# EAGLE design CCM_0020_transmitter (EAGLE 9.3.2)
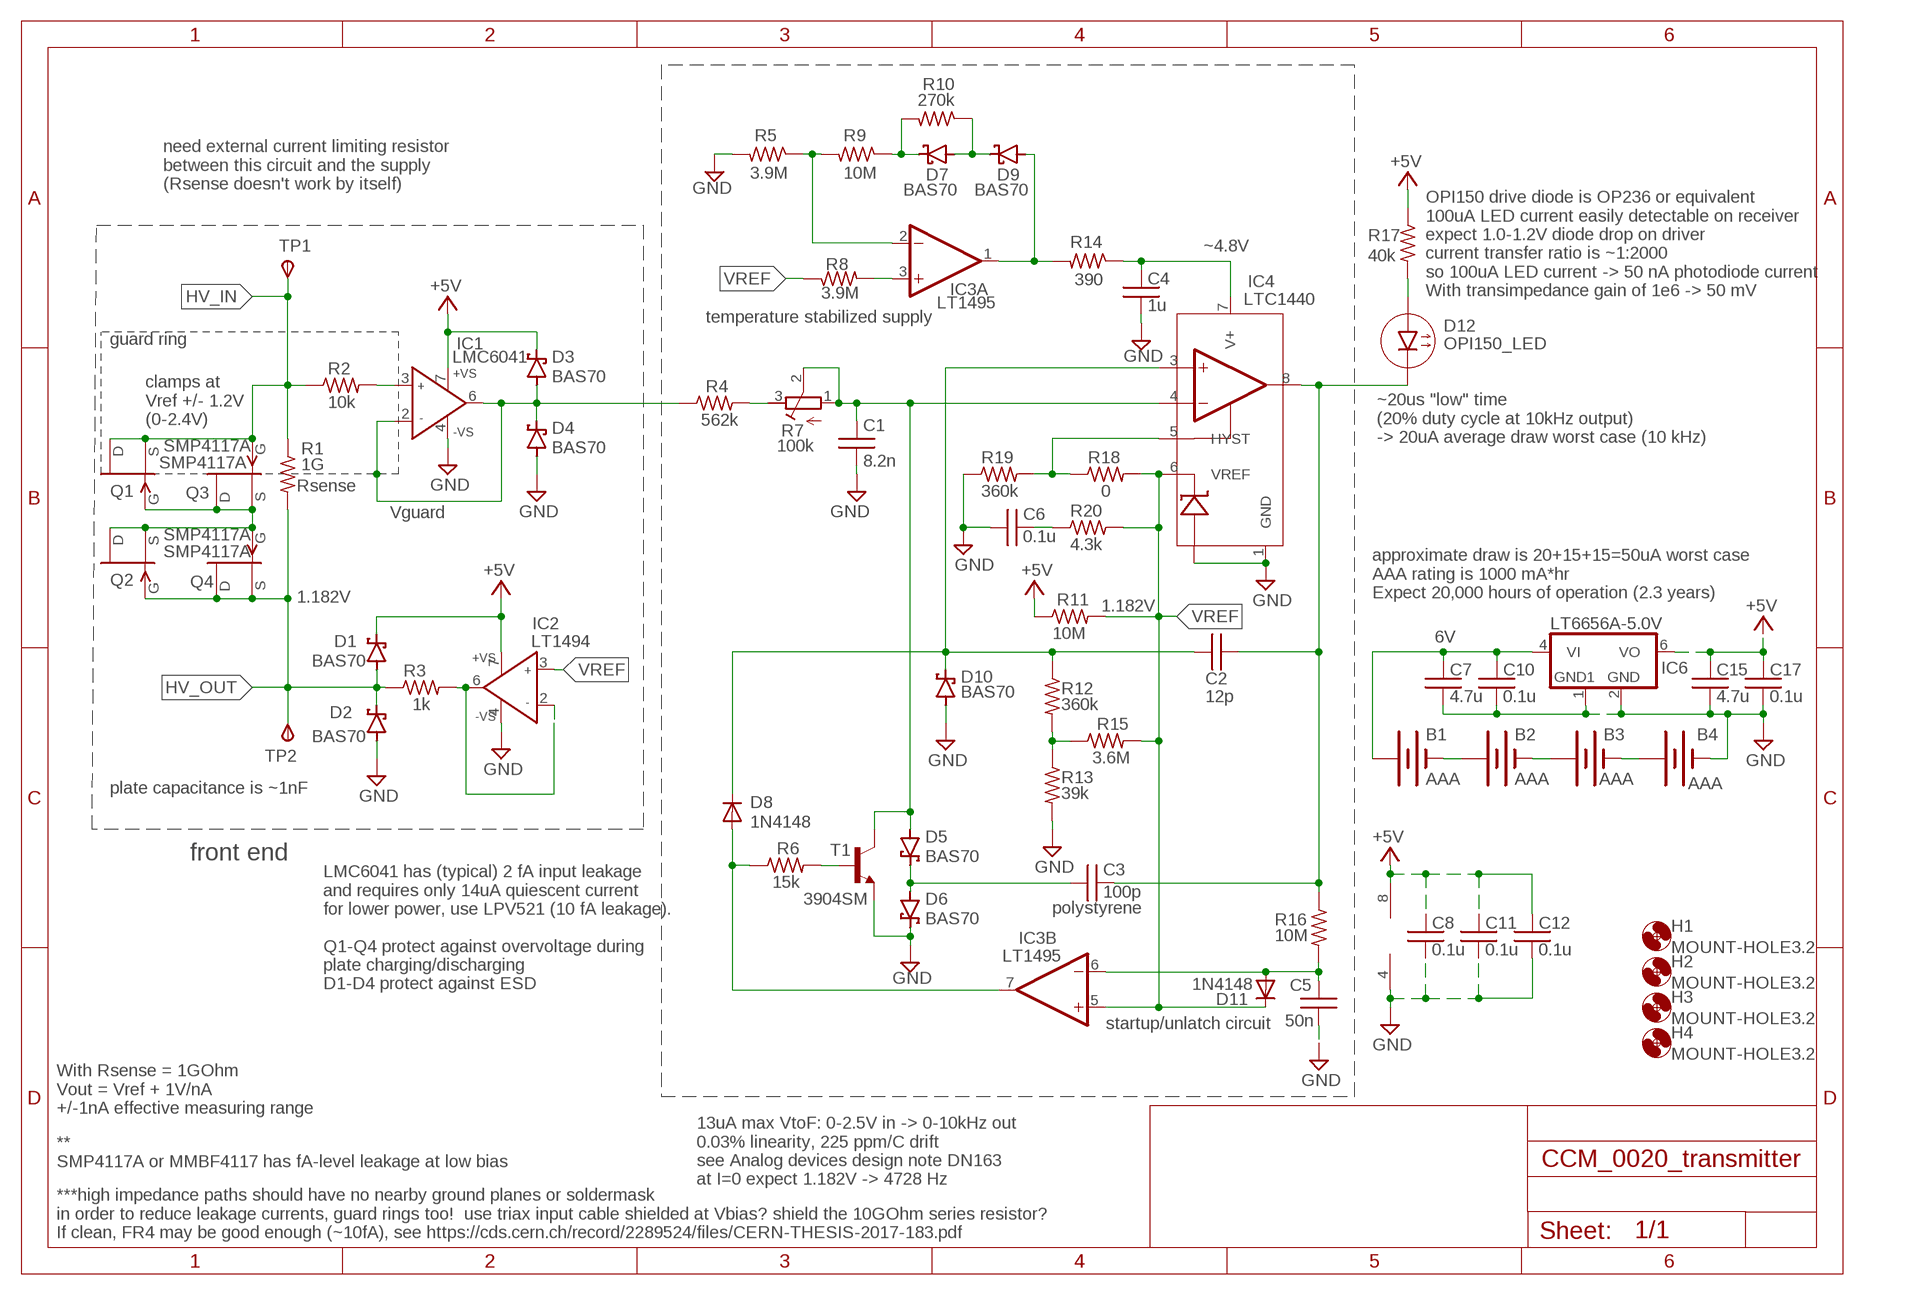
[diagram p0: schematic, sheet 1]

## Parts
B1  AAA  [AAA_SM]
B2  AAA  [AAA_SM]
B3  AAA  [AAA_SM]
B4  AAA  [AAA_SM]
C1  8.2n  C0603  [0603]
C2  12p  C0603  [0603]
C3  100p  C0603  [0603]
C4  1u  C0603  [0603]
C5  50n  C0603  [0603]
C6  0.1u  C0603  [0603]
C7  4.7u  C0603  [0603]
C8  0.1u  C0603  [0603]
C10  0.1u  C0603  [0603]
C11  0.1u  C0603  [0603]
C12  0.1u  C0603  [0603]
C15  4.7u  C0603  [0603]
C17  0.1u  C0603  [0603]
D1  BAS70  [SOT23]
D2  BAS70  [SOT23]
D3  BAS70  [SOT23]
D4  BAS70  [SOT23]
D5  BAS70  [SOT23]
D6  BAS70  [SOT23]
D7  BAS70  [SOT23]
D8  1N4148  [SOD323_ST]
D9  BAS70  [SOT23]
D10  BAS70  [SOT23]
D11  1N4148  [SOD323_ST]
D12  OPI150_LED  [OPI150_LED]
H1  MOUNT-HOLE3.2  [3,2]
H2  MOUNT-HOLE3.2  [3,2]
H3  MOUNT-HOLE3.2  [3,2]
H4  MOUNT-HOLE3.2  [3,2]
IC1  LMC6041  AD825_A  [SO08]
IC2  LT1494  AD825_A  [SO08]
IC3  LT1495  LM393D  [SO08]
IC4  LTC1440  [SO8]
IC6  LT6656A-5.0V  LT6656  [SOT23-6]
Q1  SMP4117A  SST5484  [SOT23]
Q2  SMP4117A  SST5484  [SOT23]
Q3  SMP4117A  SST5484  [SOT23]
Q4  SMP4117A  SST5484  [SOT23]
R1  1G  RESISTOR2512  [2512]
R2  10k  R0603  [0603]
R3  1k  R0603  [0603]
R4  562k  R0603  [0603]
R5  3.9M  R0603  [0603]
R6  15k  R0603  [0603]
R7  100k  R-TRIMM64Y  [RTRIM64Y]
R8  3.9M  R0603  [0603]
R9  10M  R0603  [0603]
R10  270k  R0603  [0603]
R11  10M  R0603  [0603]
R12  360k  R0603  [0603]
R13  39k  R0603  [0603]
R14  390  R0603  [0603]
R15  3.6M  R0603  [0603]
R16  10M  R0603  [0603]
R17  40k  R0603  [0603]
R18  0  R0603  [0603]
R19  360k  R0603  [0603]
R20  4.3k  R0603  [0603]
T1  3904SM  [SOT23]
TP1  TPSPAD1-17  [P1-17]
TP2  TPSPAD1-17  [P1-17]

## Nets
+5V: C8.1 C11.1 C12.1 C15.1 C17.1 D1.3(C) D3.3(C) IC1.7(+VS) IC2.7(+VS) IC3.8(P:V+) IC6.6(VO) R11.1 R17.1
GND: B4.- C1.2 C4.2 C5.2 C6.1 C7.2 C8.2 C10.2 C11.2 C12.2 C15.2 C17.2 D2.1(A) D4.1(A) D6.3(C) D10.1(A) IC1.4(-VS) IC2.4(-VS) IC3.4(P:V-) IC4.1(GND) IC4.2(V-) IC6.1(GND1) IC6.2(GND) R5.2 R13.2 R19.1 T1.2(E)
HV_IN: Q1.1(D) Q1.2(S) Q3.3(G) R1.1 R2.1 TP1.TP(PP)
HV_IN1: Q1.3(G) Q2.1(D) Q2.2(S) Q3.1(D) Q3.2(S) Q4.3(G)
HV_OUT: D1.1(A) D2.3(C) Q2.3(G) Q4.1(D) Q4.2(S) R1.2 R3.1 TP2.TP(PP)
N$1: D3.1(A) D4.3(C) IC1.2(IN-) IC1.6(OUT) R4.1
N$2: IC4.5(HYST) R18.1 R19.2
N$3: D12.P$1(1(A)) R17.2
N$4: B1.- B2.+
N$5: C6.2 R20.1
N$6: C5.1 D11.A IC3.6(B:-IN) R16.2
N$7: IC1.3(IN+) R2.2
N$8: R4.2 R7.3(E)
N$10: C1.1 D5.1(A) IC4.4(-IN) R7.1(A) R7.2(S) T1.3(C)
N$11: C3.1 D5.3(C) D6.1(A)
N$12: R6.2 T1.1(B)
N$13: D8.A IC3.7(B:OUT) R6.1
N$14: R12.2 R13.1 R15.1
N$15: C2.1 D8.C D10.3(C) IC4.3(+IN) R12.1
N$18: D7.1(A) D9.3(C) R10.1
N$19: D7.3(C) R9.1 R10.2
N$20: IC3.2(A:-IN) R5.1 R9.2
N$22: B1.+ C7.1 C10.1 IC6.4(VI)
N$23: D9.1(A) IC3.1(A:OUT) R14.2
N$24: C4.1 IC4.7(V+) R14.1
N$25: IC3.3(A:+IN) R8.2
N$26: B2.- B3.+
N$27: B3.- B4.+
N$28: IC2.2(IN-) IC2.6(OUT) R3.2
VREF: D11.C IC2.3(IN+) IC3.5(B:+IN) IC4.6(VREF) R8.1 R11.2 R15.2 R18.2 R20.2
VTOF_OUTPUT: C2.2 C3.2 D12.P$2(2(C)) IC4.8(OUT) R16.1

## Notes on the sheet
- need external current limiting resistor
  between this circuit and the supply
  (Rsense doesn't work by itself)
- ~4.8V
- OPI150 drive diode is OP236 or equivalent
  100uA LED current easily detectable on receiver
  expect 1.0-1.2V diode drop on driver
  current transfer ratio is ~1:2000
  so 100uA LED current -> 50 nA photodiode current
  With transimpedance gain of 1e6 -> 50 mV
- temperature stabilized supply
- guard ring
- clamps at 
  Vref +/- 1.2V
  (0-2.4V)
- ~20us "low" time
  (20% duty cycle at 10kHz output)
  -> 20uA average draw worst case (10 kHz)
- Rsense
- Vguard
- approximate draw is 20+15+15=50uA worst case
  AAA rating is 1000 mA*hr
  Expect 20,000 hours of operation (2.3 years)
- 1.182V
- 1.182V
- 6V
- plate capacitance is ~1nF
- front end
- polystyrene
- LMC6041 has (typical) 2 fA input leakage
  and requires only 14uA quiescent current
  for lower power, use LPV521 (10 fA leakage).
  
  Q1-Q4 protect against overvoltage during 
  plate charging/discharging  
  D1-D4 protect against ESD
- startup/unlatch circuit
- With Rsense = 1GOhm
  Vout = Vref + 1V/nA
  +/-1nA effective measuring range
- **
  SMP4117A or MMBF4117 has fA-level leakage at low bias
- 13uA max VtoF: 0-2.5V in -> 0-10kHz out
  0.03% linearity, 225 ppm/C drift
  see Analog devices design note DN163
  at I=0 expect 1.182V -> 4728 Hz
- ***high impedance paths should have no nearby ground planes or soldermask
  in order to reduce leakage currents, guard rings too!  use triax input cable shielded at Vbias? shield the 10GOhm series resistor?
  If clean, FR4 may be good enough (~10fA), see https://cds.cern.ch/record/2289524/files/CERN-THESIS-2017-183.pdf

## Library data of the parts
B1-B4 = noah:AAA
C1-C8 C10-C12 C15 C17 = acrooptics:C: Capacitor
D1-D7 D9 D10 = diode:BAS70: Silicon Schottky Diodes General-purpose diode for high-speed switching
D8 D11 = custom_parts:1N4148: DIODE high speed (Philips)
D12 = noah:OPI150_LED
H1-H4 = holes:MOUNT-HOLE: MOUNTING HOLE with drill center marker
IC1 IC2 = noah:AD825_A: Low Cost, General-Purpose High Speed JFET Amplifier Source: http://www.analog.com/static/imported-files/data_sheets/AD825.pdf
IC3 = linear:LM393: COMPARATOR
IC4 = noah:LTC1440
IC6 = noah:LT6656
Q1-Q4 = transistor-fet:?548*: N-Channel JFETs Source: VISHAY 2N5484.pdf Compatible: TO92 2N5245 J304 J305 U310 J308 J309 J310 TO72 2N4416 2N4416A 2N3823 2N4351 3N169 3N170 3N171 MFE3002 TO18 2N3796 2N3797 MFE825 Source: Motorola European Master Guide Pacge 3-59
R1 = noah:RESISTOR: RESISTOR, American symbol
R2-R6 R8-R20 = acrooptics:R: 0603 resistor
R7 = rcl:R-TRIMM: Trimm resistor; SPICEMODEL: X; SPICEPREFIXL: POT
T1 = noah:3904: NPN TRANSISTOR
TP1 TP2 = testpad:TPS: TEST PIN

## Net classes
1 standard: width 0.61 mm, clearance 0.254 mm

## Board
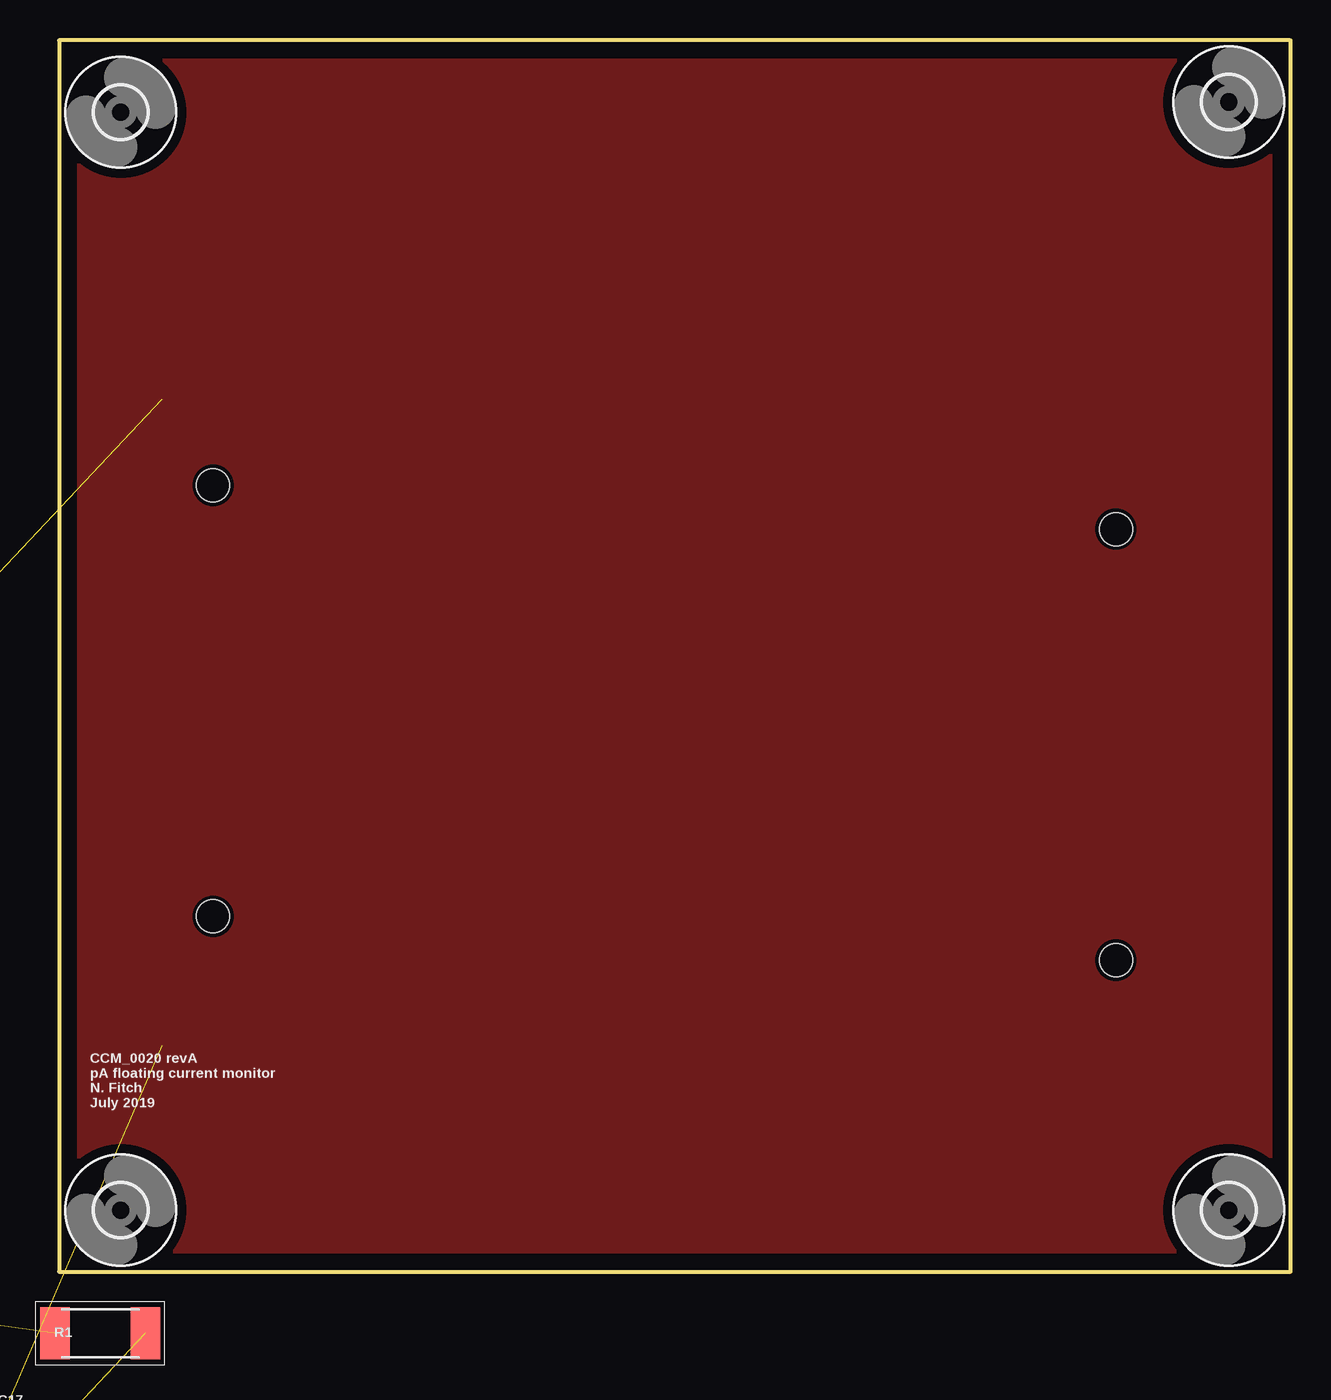
[diagram p1: board, top side]
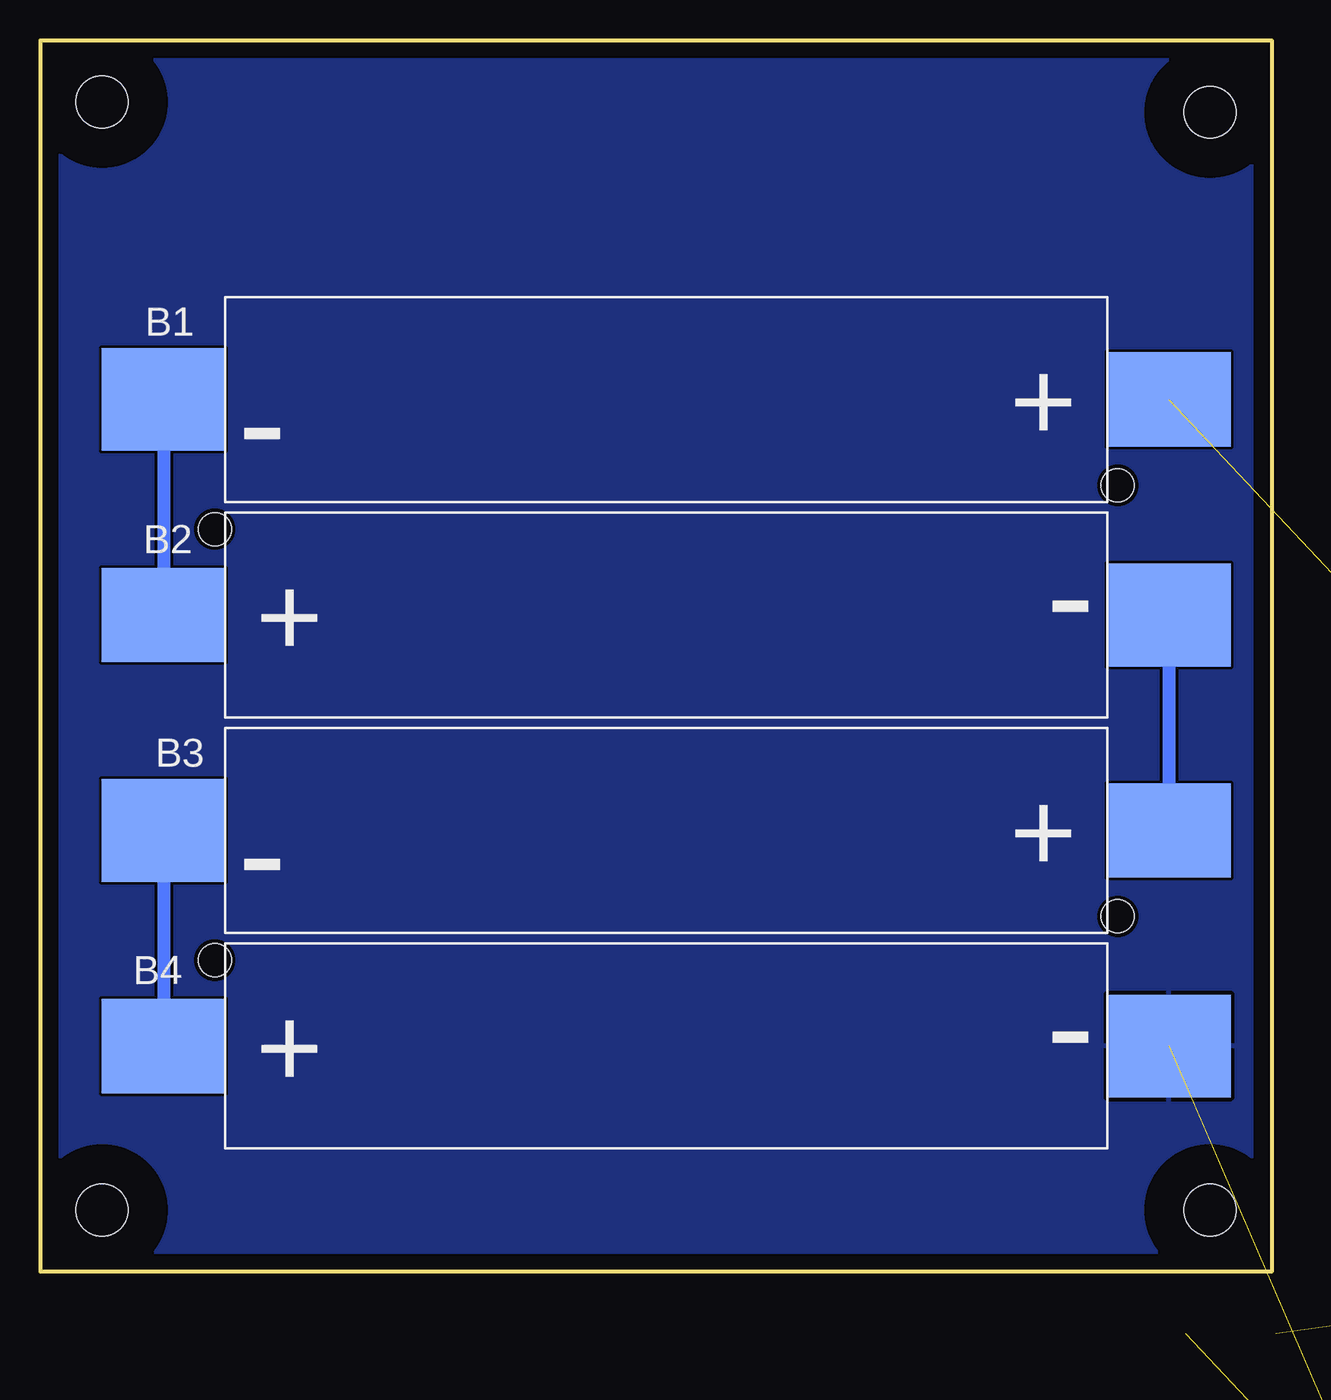
[diagram p2: board, bottom side, seen from below]

Size 76.2 x 76.2 mm. Coordinates in mm from the lower left corner, seen from the top.
Outline: 0,0 76.2,0 76.2,76.2 0,76.2 0,0
Copper layers (1*16): Top 0.035mm / dielectric 1.5mm / Bottom 0.035mm
Design rules "default *": minimum track width 10mil, minimum drill 10mil, track to track 7mil, track to pad 7mil, pad to pad 7mil, via to via 7mil, smd to smd 7mil, copper to edge 10mil, drill to drill 8mil, minimum pad ring 10mil, minimum via ring 8mil, stop-mask expansion 4mil, vias tented up to drill 0mil, thermal gap 10mil

### Footprints (pad centres in the part's own frame; a part is rotated, then mirrored left to right if it is on the bottom)
AAA_SM = smd 7.62 x 5.842: + -3.175,0 | smd 7.62 x 6.35: - 59.055,0 | hole 2.032: 0,5.309
0603 = smd 1.016 x 1.016: 1 -0.889,0; 2 0.889,0
SOT23 = smd 1 x 1.4: 1 -0.95,-1.1; 2 0.95,-1.1; 3 0,1.1
SOD323_ST = smd 0.8 x 0.6: A 1.25,0; C -1.25,0
OPI150_LED = drill 0.6 square: P$1 0,1.27 | drill 0.6: P$2 0,-1.27
3,2 = hole 3.2: 0,0
SO08 = smd 0.61 x 2.21: 1 -1.905,-2.616; 2 -0.635,-2.616; 3 0.635,-2.616; 4 1.905,-2.616; 5 1.905,2.616; 6 0.635,2.616; 7 -0.635,2.616; 8 -1.905,2.616
SO08' = smd 0.6 x 2.2: 1 -1.905,-2.6; 2 -0.635,-2.6; 3 0.635,-2.6; 4 1.905,-2.6; 5 1.905,2.6; 6 0.635,2.6; 7 -0.635,2.6; 8 -1.905,2.6
SO8 = smd 0.6 x 2.2: 1 -1.905,-2.6; 2 -0.635,-2.6; 3 0.635,-2.6; 4 1.905,-2.6; 5 1.905,2.6; 6 0.635,2.6; 7 -0.635,2.6; 8 -1.905,2.6
SOT23-6 = smd 0.6 x 0.9: 1 -0.95,-1.15; 2 0,-1.15; 3 0.95,-1.15; 4 0.95,1.15; 5 0,1.15; 6 -0.95,1.15
2512 = smd 1.8 x 3.2: 1 -2.8,0; 2 2.8,0
RTRIM64Y = drill 0.61: 1 0,-2.54; 2 -2.54,0; 3 0,2.54
P1-17 = drill 1.702 pad 2.54 octagon: TP 0,0

### Placement (x,y rotation side)
B1  9.53,53.98 180 bottom
B2  65.41,40.64 0 bottom
B3  9.53,27.3 180 bottom
B4  65.41,13.97 0 bottom
C1  -150.69,-129.73 0 top  (outside the outline)
C2  -167.7,-164.59 0 top  (outside the outline)
C3  -171.96,-164.59 0 top  (outside the outline)
C4  -214.5,-184.59 0 top  (outside the outline)
C5  -180.47,-169.67 0 top  (outside the outline)
C6  -307.34,-441.96 0 top  (outside the outline)
C7  -245.3,-219.46 0 top  (outside the outline)
C8  -227.71,-194.44 0 top  (outside the outline)
C10  -245.3,-215.07 0 top  (outside the outline)
C11  -231.97,-194.44 0 top  (outside the outline)
C12  -267.08,-319.21 0 top  (outside the outline)
C15  -3.17,-12.06 180 top  (outside the outline)
C17  -3.17,-10.16 180 top  (outside the outline)
D1  -288.93,-413.38 0 top  (outside the outline)
D2  -288.93,-421 0 top  (outside the outline)
D3  -288.93,-398.14 0 top  (outside the outline)
D4  -288.93,-405.76 0 top  (outside the outline)
D5  -150.56,-135.76 0 top  (outside the outline)
D6  -150.56,-150.62 0 top  (outside the outline)
D7  -184.59,-183.2 0 top  (outside the outline)
D8  -155.07,-156.91 0 top  (outside the outline)
D9  -184.59,-175.77 0 top  (outside the outline)
D10  -154.81,-163.19 0 top  (outside the outline)
D11  -176.34,-169.48 0 top  (outside the outline)
D12  -287.65,-328.3 0 top  (outside the outline)
H1  3.81,3.81 0 top
H2  72.39,3.81 0 top
H3  3.81,71.75 0 top
H4  72.39,72.39 0 top
IC1  -282.57,-317.5 0 top  (outside the outline)
IC2  -238.76,-202.76 0 top  (outside the outline)
IC3  LT1495  [SO08']  -221.23,-192.91 0 top  (outside the outline)
IC4  -211.77,-192.34 0 top  (outside the outline)
IC6  -241.36,-209.8 0 top  (outside the outline)
Q1  -55.94,-83.44 0 top  (outside the outline)
Q2  -288.93,-344.17 0 top  (outside the outline)
Q3  -6.73,-4 0 top  (outside the outline)
Q4  -288.93,-336.55 0 top  (outside the outline)
R1  2.54,-3.81 0 top  (outside the outline)
R2  -28.19,-34.35 0 top  (outside the outline)
R3  -289.56,-318.77 0 top  (outside the outline)
R4  -142.18,-129.73 0 top  (outside the outline)
R5  -197.49,-184.59 0 top  (outside the outline)
R6  -154.94,-152.02 0 top  (outside the outline)
R7  -285.75,-439.42 0 top  (outside the outline)
R8  -201.74,-184.59 0 top  (outside the outline)
R9  -193.23,-184.59 0 top  (outside the outline)
R10  -188.98,-184.59 0 top  (outside the outline)
R11  -205.99,-184.59 0 top  (outside the outline)
R12  -159.19,-164.59 0 top  (outside the outline)
R13  -163.45,-164.59 0 top  (outside the outline)
R14  -210.25,-184.59 0 top  (outside the outline)
R15  -176.21,-164.59 0 top  (outside the outline)
R16  -184.72,-169.67 0 top  (outside the outline)
R17  -129.41,-129.73 0 top  (outside the outline)
R18  -294,-441.96 0 top  (outside the outline)
R19  -298.45,-441.96 0 top  (outside the outline)
R20  -302.89,-441.96 0 top  (outside the outline)
T1  -150.56,-143.19 0 top  (outside the outline)
TP1  -289.56,-427.99 0 top  (outside the outline)
TP2  -289.56,-433.07 0 top  (outside the outline)

### Tracks (layer width: path | path; a pad name or v marks a point on that pad's centre or on a via)
+5V  (12 unrouted)
  pour Top: 1.27,1.27 1.27,74.93 74.93,74.93 74.93,1.27
GND  (26 unrouted)
  pour Bottom: 1.27,1.27 1.27,74.93 74.93,74.93 74.93,1.27
HV_IN  (5 unrouted)
HV_IN1  (5 unrouted)
HV_OUT  (7 unrouted)
N$1  (4 unrouted)
N$2  (2 unrouted)
N$3  (1 unrouted)
N$4
  Bottom 0.813: B1.- B2.+
N$5  (1 unrouted)
N$6  (3 unrouted)
N$7  (1 unrouted)
N$8  (1 unrouted)
N$10  (5 unrouted)
N$11  (2 unrouted)
N$12  (1 unrouted)
N$13  (2 unrouted)
N$14  (2 unrouted)
N$15  (4 unrouted)
N$18  (2 unrouted)
N$19  (2 unrouted)
N$20  (2 unrouted)
N$22  (3 unrouted)
N$23  (2 unrouted)
N$24  (2 unrouted)
N$25  (1 unrouted)
N$26
  Bottom 0.813: B2.- B3.+
N$27
  Bottom 0.813: B3.- B4.+
N$28  (2 unrouted)
VREF  (8 unrouted)
VTOF_OUTPUT  (4 unrouted)

### Text on the board
tPlace: CCM_0020 revA / pA floating current monitor / N. Fitch / July 2019